# EAGLE design ENC424J600-breakout (EAGLE 6.5.0)
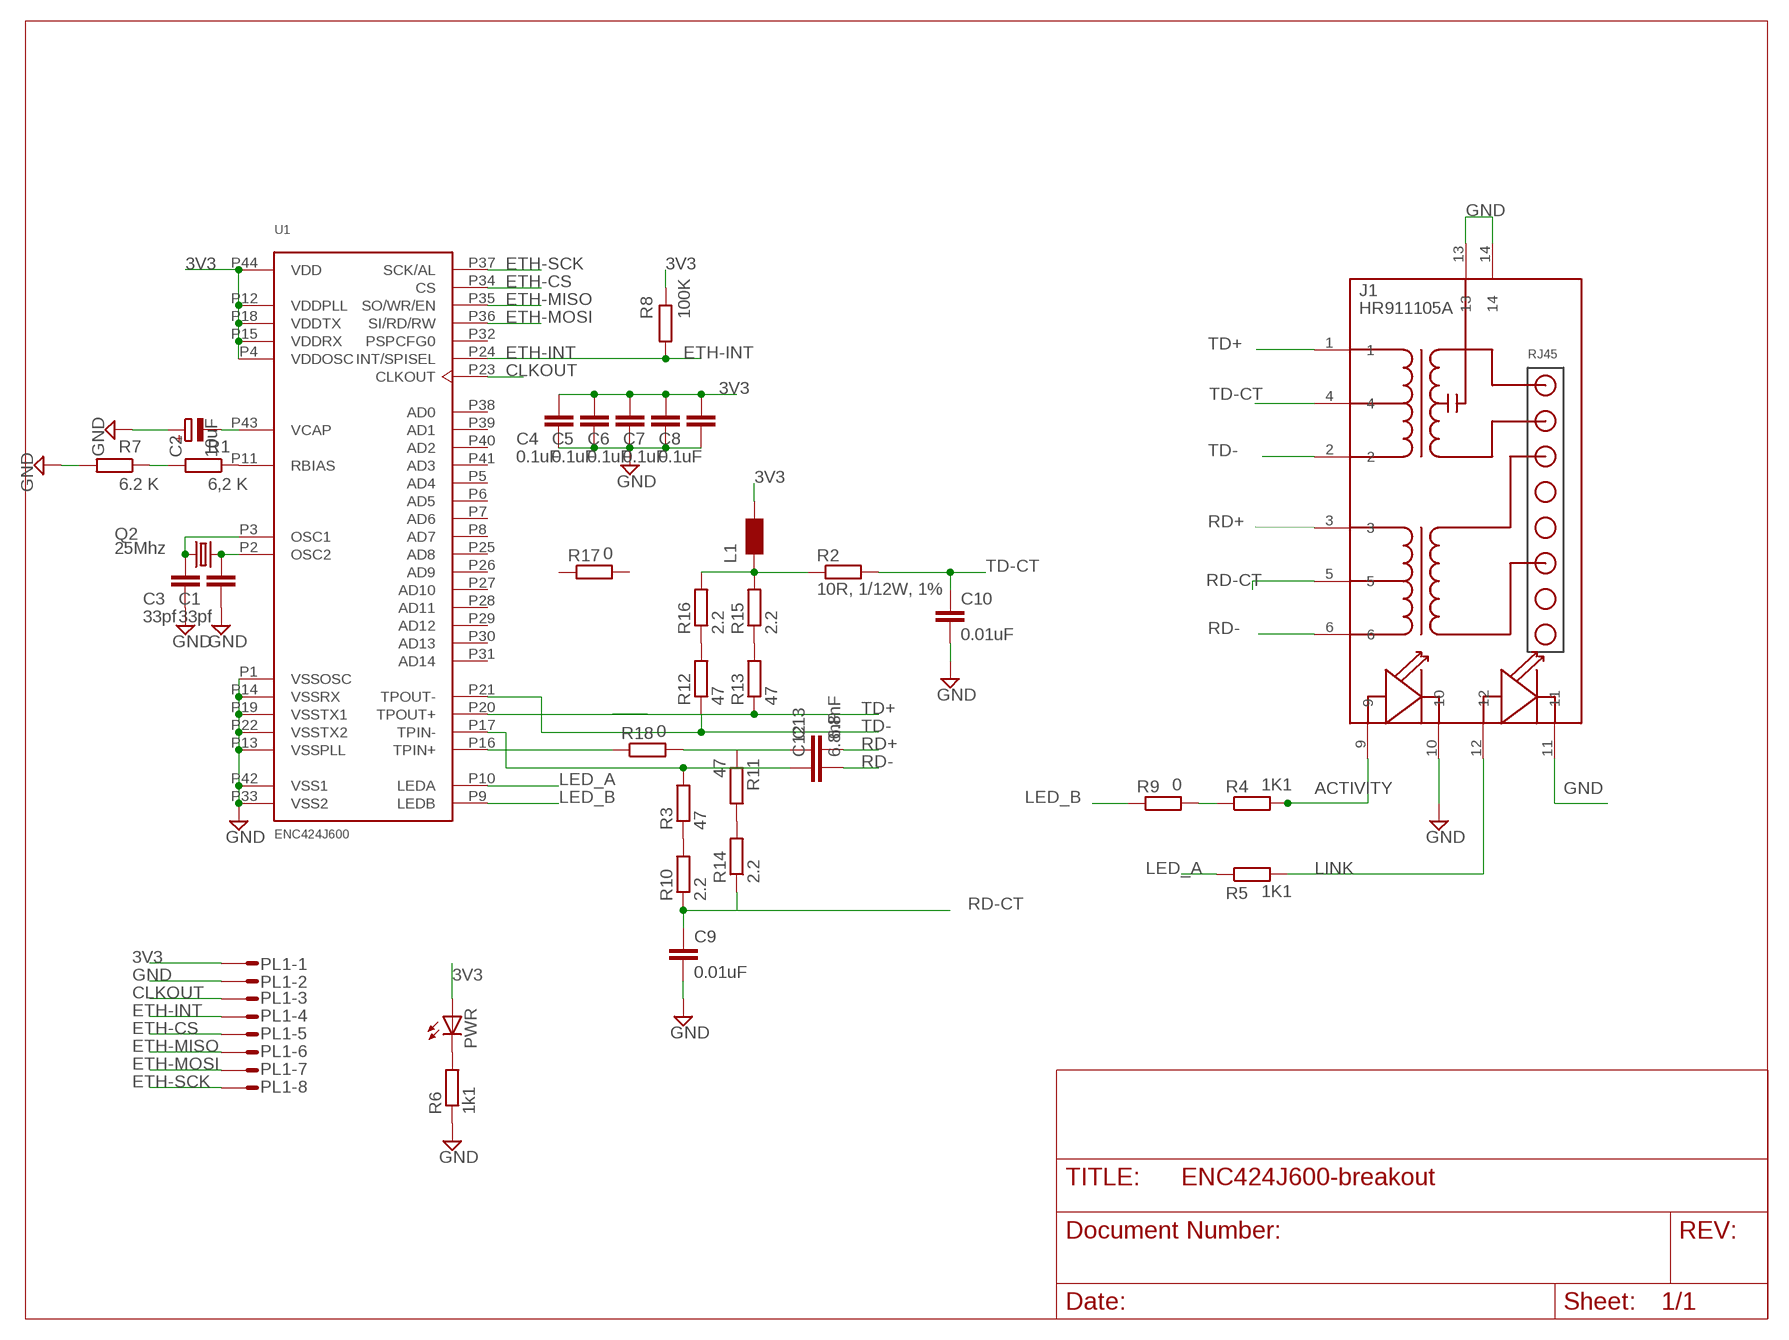
[diagram p0: schematic, sheet 1]

## Parts
C1  33pf  C-EU050-024X044  [C050-024X044]
C2  10uF  CPOL-EUE2.5-5  [E2,5-5]
C3  33pf  C-EU050-024X044  [C050-024X044]
C4  0.1uF  C-EU050-024X044  [C050-024X044]
C5  0.1uF  C-EU050-024X044  [C050-024X044]
C6  0.1uF  C-EU050-024X044  [C050-024X044]
C7  0.1uF  C-EU050-024X044  [C050-024X044]
C8  0.1uF  C-EU050-024X044  [C050-024X044]
C9  0.01uF  C-EU050-030X075  [C050-030X075]
C10  0.01uF  C-EU050-025X075  [C050-025X075]
C12  6.8nF  C-EU050-024X044  [C050-024X044]
C13  6.8nF  C-EU050-024X044  [C050-024X044]
J1  HR911105A  [HR911105A]
L1  WE-KIL_0805  [WE-KI_0805_B]
PL1  10VS  [10V]
PWR  LED805  [LED-805]
Q2  25Mhz  CRYSTALHC49U70  [HC49U70]
R1  6,2 K  R-EU_0207/7  [0207/7]
R2  10R, 1/12W, 1%  R-EU_0207/7  [0207/7]
R3  47  R-EU_0207/7  [0207/7]
R4  1K1  R-EU_0204/5  [0204/5]
R5  1K1  R-EU_0204/5  [0204/5]
R6  1k1  R-EU_0204/5  [0204/5]
R7  6.2 K  R-EU_0207/7  [0207/7]
R8  100K  R-EU_0207/7  [0207/7]
R9  0  R-EU_0204/5  [0204/5]
R10  2.2  R-EU_0207/7  [0207/7]
R11  47  R-EU_0207/7  [0207/7]
R12  47  R-EU_0207/7  [0207/7]
R13  47  R-EU_0207/7  [0207/7]
R14  2.2  R-EU_0207/7  [0207/7]
R15  2.2  R-EU_0207/7  [0207/7]
R16  2.2  R-EU_0207/7  [0207/7]
R17  0  R-EU_0204/5  [0204/5]
R18  0  R-EU_0204/5  [0204/5]
U1  ENC424J600  [TQFP44]

## Nets
3V3: C4.1 C5.1 C6.1 C7.1 C8.1 L1.1 PL1.1 PWR.A R8.1 U1.P4(VDDOSC) U1.P12(VDDPLL) U1.P15(VDDRX) U1.P18(VDDTX) U1.P44(VDD)
ACTIVITY: J1.9 R4.2
CCT: L1.2 R2.1 R15.2 R16.2
CLKOUT: PL1.3 U1.P23(CLKOUT)
DSFGDF: C12.1 R3.2 U1.P17(TPIN-)
DSGDFSG: C13.1 R11.1 R18.2
ETH-CS: PL1.5 U1.P34(CS)
ETH-INT: PL1.4 R8.2 U1.P24(INT/SPISEL)
ETH-MISO: PL1.6 U1.P35(SO/WR/EN)
ETH-MOSI: PL1.7 U1.P36(SI/RD/RW)
ETH-SCK: PL1.8 U1.P37(SCK/AL)
GND: C1.2 C2.+ C3.2 C4.2 C5.2 C6.2 C7.2 C8.2 C9.2 C10.2 J1.10 J1.11 J1.13 J1.14 PL1.2 R6.1 R7.2 U1.P1(VSSOSC) U1.P13(VSSPLL) U1.P14(VSSRX) U1.P19(VSSTX1) U1.P22(VSSTX2) U1.P33(VSS2) U1.P42(VSS1)
LED_A: R5.1 U1.P10(LEDA)
LED_B: R9.1 U1.P9(LEDB)
LINK: J1.12 R5.2
N$1: C2.- U1.P43(VCAP)
N$2: R1.1 U1.P11(RBIAS)
N$3: PWR.C R6.2
N$4: C3.1 Q2.1 U1.P3(OSC1)
N$5: R1.2 R7.1
N$6: R3.1 R10.2
N$7: R11.2 R14.2
N$8: C1.1 Q2.2 U1.P2(OSC2)
N$9: R13.2 R15.1
N$10: R12.2 R16.1
N$11: R4.1 R9.2
N$12: R18.1 U1.P16(TPIN+)
RD+: C13.2 J1.3
RD-: C12.2 J1.6
RD-CT: C9.1 J1.5 R10.1 R14.1
TD+: J1.1 R13.1 U1.P20(TPOUT+)
TD-: J1.2 R12.1 U1.P21(TPOUT-)
TD-CT: C10.1 J1.4 R2.2
Unconnected: PL1.9 PL1.10 R17.1 R17.2 U1.P5(AD4) U1.P6(AD5) U1.P7(AD6) U1.P8(AD7) U1.P25(AD8) U1.P26(AD9) U1.P27(AD10) U1.P28(AD11) U1.P29(AD12) U1.P30(AD13) U1.P31(AD14) U1.P32(PSPCFG0) U1.P38(AD0) U1.P39(AD1) U1.P40(AD2) U1.P41(AD3)

## Library data of the parts
C1 C3-C10 C12 C13 = rcl:C-EU: CAPACITOR, European symbol
C2 = resistor:CPOL-EU: POLARIZED CAPACITOR, European symbol
J1 = CONNECTER:HR911105A
L1 = wuerth-elektronik:WE-KIL: SMD Wire Wound Ceramic Inductor WE-KIL - Low profile - High Q values -- Bluetooth -- Wireless LAN -- RF oscillation circuit -- IF impedance matching
PL1 = con-harting-v:10VS: CONNECTOR; OC_FARNELL: unknown; OC_NEWARK: unknown
PWR = dp_devices:LED
Q2 = crystal:CRYSTAL: CRYSTAL; OC_FARNELL: unknown; OC_NEWARK: unknown
R1-R5 R7-R18 = rcl:R-EU_: RESISTOR, European symbol
R6 = resistor:R-EU_: RESISTOR, European symbol
U1 = dp_devices:ENC424J600: Stand-Alone 10/100 Ethernet Controller with SPI or Parallel Interface Source: http://ww1.microchip.com/downloads/en/DeviceDoc/39935c.pdf

## Board
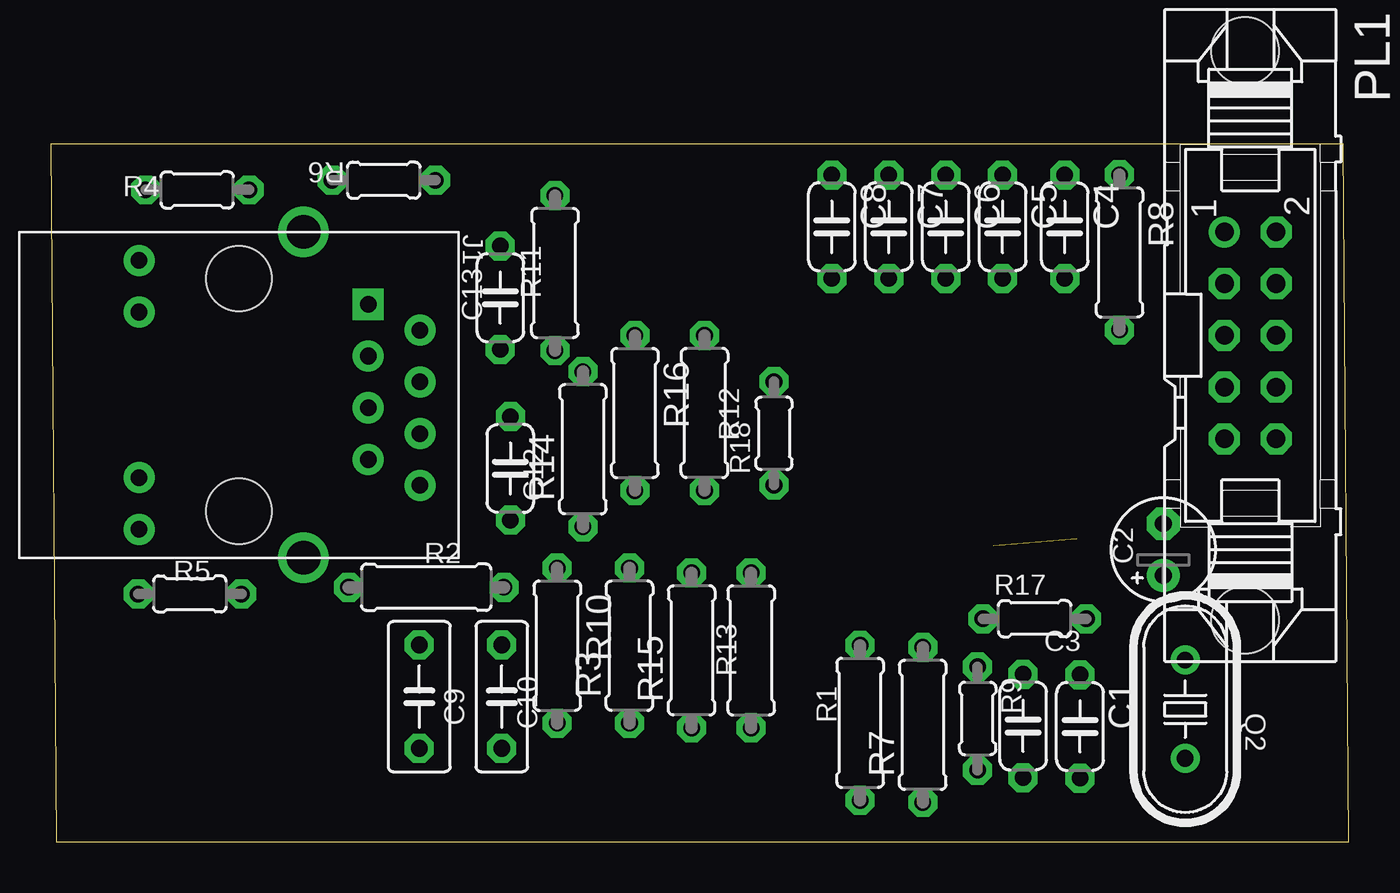
[diagram p1: board, top side]
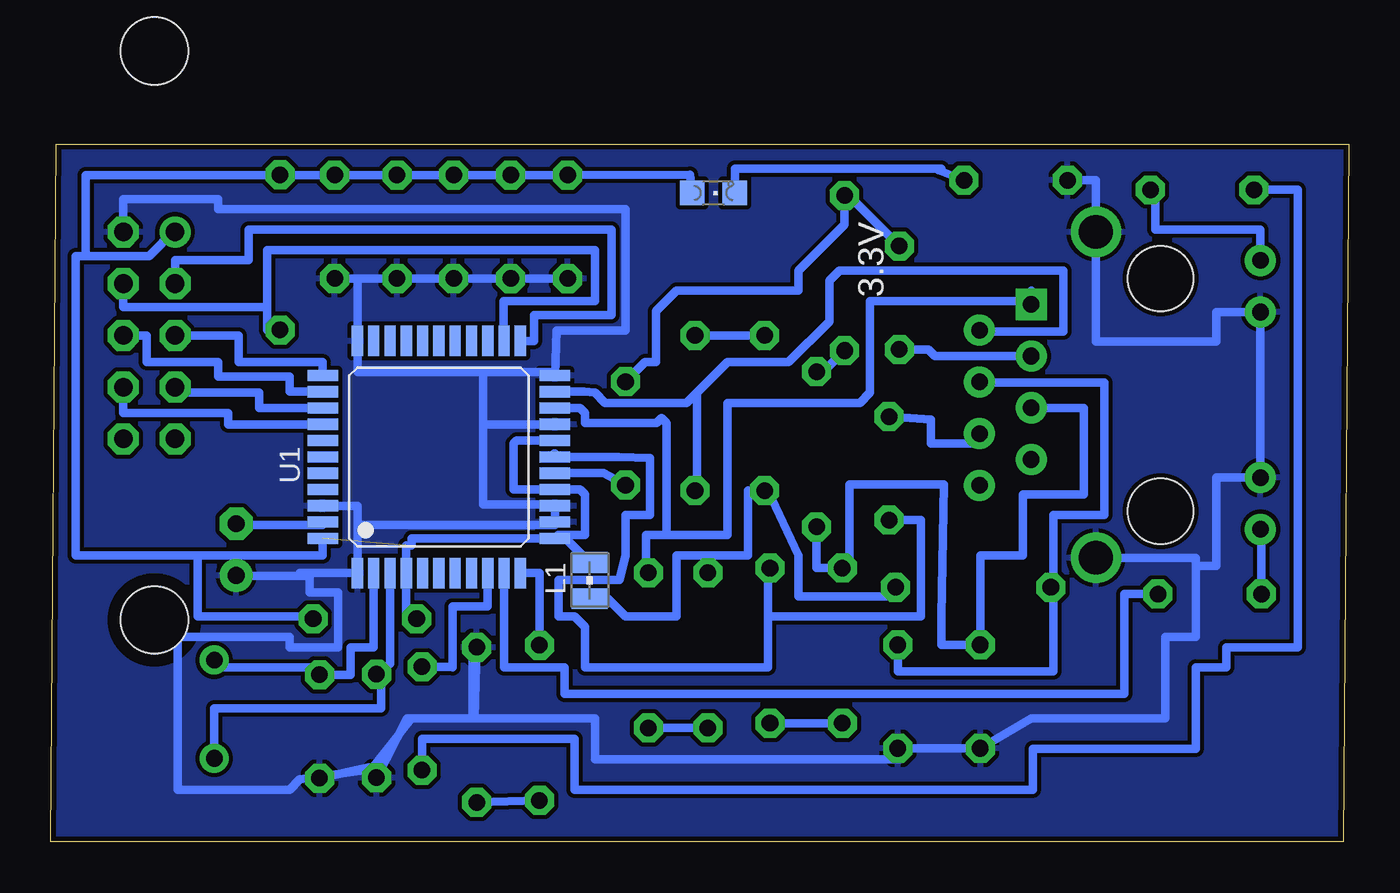
[diagram p2: board, bottom side, seen from below]

Size 63.71 x 34.27 mm. Coordinates in mm from the lower left corner, seen from the top.
Outline: 0.25,0 63.71,0 63.46,34.27 0,34.27 0.25,0
Copper layers (1*16): Top 0.035mm / dielectric 1.5mm / Bottom 0.035mm
Design rules "SparkFun *": minimum track width 8mil, minimum drill 15mil, track to track 8mil, track to pad 8mil, pad to pad 8mil, via to via 8mil, smd to smd 8mil, copper to edge 10mil, drill to drill 8mil, minimum pad ring 12mil, minimum via ring 10mil, stop-mask expansion 4mil, vias tented up to drill 25mil, thermal gap 8mil

### Footprints (pad centres in the part's own frame; a part is rotated, then mirrored left to right if it is on the bottom)
C050-024X044 = drill 0.813 octagon: 1 -2.54,0; 2 2.54,0
E2,5-5 = drill 0.813 pad 1.6: + -1.27,0 | drill 0.813 pad 1.6 octagon: - 1.27,0
C050-030X075 = drill 0.813 octagon: 1 -2.54,0; 2 2.54,0
C050-025X075 = drill 0.813 octagon: 1 -2.54,0; 2 2.54,0
HR911105A = drill 0.813 pad 1.524 square: 1 4.445,-6.35 | drill 0.813 pad 1.524: 2 3.175,-8.89; 3 1.905,-6.35; 4 0.635,-8.89; 5 -0.635,-6.35; 6 -1.905,-8.89; 7 -3.175,-6.35; 8 -4.445,-8.89; 9 6.604,4.902; 10 4.064,4.902; 11 -4.064,4.902; 12 -6.604,4.902 | drill 1.651 pad 2.159: 13 8.001,-3.175; 14 -8.001,-3.175 | hole 3.2: 5.715,0; -5.715,0
WE-KI_0805_B = smd 1.02 x 1.78: 1 -0.89,0; 2 0.89,0
10V = drill 0.914: 1 -5.08,-1.27 | drill 0.914 octagon: 2 -5.08,1.27; 3 -2.54,-1.27; 4 -2.54,1.27; 5 0,-1.27; 6 0,1.27; 7 2.54,-1.27; 8 2.54,1.27; 9 5.08,-1.27; 10 5.08,1.27 | hole 3.302: 13.97,-0.254; -13.97,-0.254
LED-805 = smd 1.2 x 1.2: A 0,-1.05; C 0,1.05
HC49U70 = drill 0.813: 1 -2.413,0; 2 2.413,0
0207/7 = drill 0.813 octagon: 1 -3.81,0; 2 3.81,0
0204/5 = drill 0.813 octagon: 1 -2.54,0; 2 2.54,0
TQFP44 = smd 0.55 x 1.5: P1 -4,-5.7; P2 -3.2,-5.7; P3 -2.4,-5.7; P4 -1.6,-5.7; P5 -0.8,-5.7; P6 0,-5.7; P7 0.8,-5.7; P8 1.6,-5.7; P9 2.4,-5.7; P10 3.2,-5.7; P11 4,-5.7; P23 4,5.7; P24 3.2,5.7; P25 2.4,5.7; P26 1.6,5.7; P27 0.8,5.7; P28 0,5.7; P29 -0.8,5.7; P30 -1.6,5.7; P31 -2.4,5.7; P32 -3.2,5.7; P33 -4,5.7 | smd 1.5 x 0.55: P12 5.7,-4; P13 5.7,-3.2; P14 5.7,-2.4; P15 5.7,-1.6; P16 5.7,-0.8; P17 5.7,0; P18 5.7,0.8; P19 5.7,1.6; P20 5.7,2.4; P21 5.7,3.2; P22 5.7,4; P34 -5.7,4; P35 -5.7,3.2; P36 -5.7,2.4; P37 -5.7,1.6; P38 -5.7,0.8; P39 -5.7,0; P40 -5.7,-0.8; P41 -5.7,-1.6; P42 -5.7,-2.4; P43 -5.7,-3.2; P44 -5.7,-4

### Placement (x,y rotation side)
C1  50.52,5.66 270 top
C2  54.62,14.35 90 top
C3  47.73,5.69 270 top
C4  49.78,30.2 270 top
C5  46.73,30.2 270 top
C6  43.93,30.2 270 top
C7  41.14,30.2 270 top
C8  38.35,30.2 270 top
C9  18.08,7.13 270 top
C10  22.14,7.13 270 top
C12  22.56,18.33 90 top
C13  22.06,26.72 270 top
J1  9.23,21.95 90 top
L1  37.27,12.83 270 bottom
PL1  58.89,24.87 270 top
PWR  31.18,31.86 270 bottom
Q2  55.69,6.51 90 top
R1  39.73,5.84 270 top
R2  18.43,12.5 180 top
R3  28.41,9.63 90 top
R4  7.18,32.01 0 top
R5  6.82,12.17 180 top
R6  16.34,32.49 0 top
R7  42.81,5.74 90 top
R8  52.46,28.94 270 top
R9  45.5,6.06 270 top
R10  24.86,9.63 270 top
R11  24.75,27.93 270 top
R12  32.09,21.06 90 top
R13  34.38,9.4 270 top
R14  26.12,19.28 90 top
R15  31.46,9.4 90 top
R16  28.67,21.06 270 top
R17  48.3,10.96 0 top
R18  35.5,20.06 90 top
U1  44.66,18.9 0 bottom

### Tracks (layer width: path | path; a pad name or v marks a point on that pad's centre or on a via)
3V3  (1 unrouted)
  Bottom 0.406: U1.P12 46,14.9 46,14.56 46.26,14.56 U1.P4 46.26,11.06 45.5,11.06 | U1.P44 50.36,14.06 56.5,14.06 | 56.5,14.06 62.5,14.06 62.5,28.76 62,28.76 | 62,28.76 58.9,28.76 57.62,30.06 PL1.1 | 56.5,14.06 56.5,11.06 50.5,11.06 | 52.5,32.74 C4.1 C5.1 C6.1 C7.1 C8.1 32.35,32.76 PWR.A | 52.5,32.74 62,32.74 62,28.76 | R8.1 52.5,32.75 52.5,32.74 | U1.P18 40.86,19.7 41,19.56 41,17.3 U1.P15 37.74,17.3 37.5,17.06 37.5,15.06 38.81,15.06 U1.P12 | L1.1 38.45,14.9 U1.P12
ACTIVITY
  Bottom 0.406: R4.2 9.5,32.01 9.5,30.06 4.33,30.06 J1.9
CCT
  Bottom 0.406: 31.46,14.06 33,14.06 33,11.06 35.5,11.06 36.38,11.94 L1.2 | 31.46,14.06 R15.2 | 31.46,14.06 29.5,14.06 29.5,17.25 R16.2 28.5,17.25 27,14.06 27,12.06 22.24,12.06 R2.1
CLKOUT
  Bottom 0.406: PL1.3 57.62,28.56 54,28.56 54,30.06 36.2,30.06 36.2,25.86 40,25.86 40,24.6 U1.P23
DSFGDF
  Bottom 0.406: R3.2 28.5,13.44 28.5,11.06 | 28.5,11.06 28.5,8.56 37.5,8.56 37.5,10.56 38,11.06 38.8,11.06 38.8,12.86 35.8,12.86 35.5,14.06 35.5,16.06 34.3,16.06 34.3,18.86 35.84,18.9 U1.P17 39,18.93 39,19.06 38.96,19.06 | C12.1 21,15.79 21,11.06 28.5,11.06
DSGDFSG
  Bottom 0.406: C13.1 24.54,31.74 R11.1 24.75,30.31 27,28.06 27,27.06 33,27.06 34,26.06 34,23.56 34.54,23.56 R18.2
ETH-CS
  Bottom 0.406: PL1.5 54.5,24.87 54.5,23.56 50.36,23.56 U1.P34
ETH-INT
  Bottom 0.406: PL1.4 60.16,26.26 53.1,26.26 | 53.1,26.26 53.1,29.06 37,29.06 37,26.56 41.5,26.56 41.5,24.6 U1.P24 | R8.2 53.1,25.13 53.1,26.26
ETH-MISO
  Bottom 0.406: PL1.6 59,24.87 59,23.56 55.5,23.56 55.5,22.86 52,22.86 52,22.1 U1.P35
ETH-MOSI
  Bottom 0.406: PL1.7 57.62,22.06 53.5,22.06 53.5,21.3 U1.P36
ETH-SCK
  Bottom 0.406: PL1.8 60.16,21.06 55,21.06 55,20.5 U1.P37
GND
  Bottom 0.406: R6.1 12.41,32.49 J1.13 12.41,24.56 6.5,24.56 6.5,26.01 J1.10 J1.11 6.5,17.88 6.5,13.56 7.5,13.56 | J1.14 7.5,13.95 7.5,13.56 | 7.5,13.56 7.5,10.06 9,10.06 9,6.06 15.58,6.06 C9.2 C10.2 22,4.09 22,4.06 37,4.06 37,6.06 42.91,6.06 | 42.91,6.06 R7.2 43,9.65 43,6.06 | C1.2 48.12,3.65 C3.2 46.23,6.06 46,6.06 | 42.91,6.06 43,6.06 | 51,13.06 51.5,13.2 U1.P1 48.66,15.56 | U1.P42 48.66,16.5 48.66,15.56 | 43,6.06 46,6.06 | 46,6.06 48,3.56 51.5,3.06 52,2.56 57.5,2.56 57.5,10.06 52,10.06 52,9.56 49.6,9.56 49.6,12.26 51,12.26 51,13.06 | 51,13.06 55.12,13.06 | 48.66,15.56 38.96,15.56 U1.P13 U1.P14 39.02,16.56 42.5,16.56 42.5,20.5 | C5.2 48.66,27.66 U1.P33 48.66,23.06 42.5,23.06 | PL1.2 60.16,31.56 55.5,31.56 55.5,31.06 35.5,31.06 35.5,25.1 38.9,25.1 U1.P22 | U1.P22 38.96,23.06 39.12,23.06 | C5.2 C4.2 | C5.2 C6.2 C7.2 C8.2 | 42.5,20.5 U1.P19 | U1.P22 arc-90 39.12,23.06 | 39.12,23.06 42.5,23.06 | 42.5,23.06 42.5,20.5
  pour Bottom: 0,34.27 63.46,34.27 63.46,0 0.25,0
LED_A
  Bottom 0.406: R5.1 11,12.17 11,7.26 38.5,7.26 38.5,8.56 41.46,8.56 U1.P10
LED_B
  Bottom 0.406: R9.1 44,8.6 | 44,8.6 44,8.56 | 44,8.6 44,11.56 42.26,11.56 U1.P9
LINK
  Bottom 0.406: J1.12 4.28,15.34 R5.2
N$1
  Bottom 0.406: C2.- 54.5,15.44 54,15.56 50.36,15.56 U1.P43
N$2
  Bottom 0.406: U1.P11 39.73,13.2 R1.1
N$3
  Bottom 0.406: R6.2 20.14,32.99 20,33.06 30.14,33.06 PWR.C
N$4
  Bottom 0.406: U1.P3 47.06,8.73 C3.1 47.5,8.73 47.5,6.56 55.69,6.56 Q2.1
N$5
  Bottom 0.406: R7.1 R1.2
N$6
  Bottom 0.406: R3.1 R10.2
N$7
  Bottom 0.406: R11.2 25.78,23.09 R14.2
N$8
  Bottom 0.406: U1.P2 47.86,9.56 49,9.56 49,8.2 C1.1 51.02,8.56 55.5,8.56 55.5,8.92 Q2.2
N$9
  Bottom 0.406: R13.2 R15.1
N$10
  Bottom 0.406: R16.1 R12.2
N$11
  Bottom 0.406: R4.1 2.5,32.01 2.5,9.56 6,9.56 6,8.56 7.5,8.56 7.5,4.56 15.5,4.56 15.5,2.56 38,2.56 38,5.06 45.5,5.06 R9.2
N$12
  Bottom 0.406: R18.1 36.58,18.1 U1.P16
RD+
  Bottom 0.406: J1.3 20.3,23.86 20.62,24.18 C13.2
RD-
  Bottom 0.406: C12.2 20.5,20.74 20.5,19.56 18.12,19.56 J1.6
RD-CT
  Bottom 0.406: J1.5 13,21.31 13,17.06 16,17.06 16,14.06 18.08,14.06 C9.1 20,9.67 20,11.06 19.86,17.56 24.5,17.56 24.5,13.44 R10.1 26.12,13.44 R14.1
TD+
  Bottom 0.406: 15.58,27.06 J1.1 15.74,26.56 23.5,26.56 23.5,22.06 24,21.56 30.5,21.56 30.5,15.06 33.5,15.06 | R13.1 34.5,13.71 34.5,15.06 33.5,15.06 | 33.5,15.06 33.5,20.56 33.74,20.8 33.99,20.56 37.5,20.56 37.5,21.06 37.74,21.3 U1.P20
TD-
  Bottom 0.406: R12.1 32,16.75 32,22.06 | J1.2 18.05,25.06 14,25.06 14,28.06 25,28.06 25.5,27.56 25.5,25.56 27.5,23.56 30.5,23.56 32,22.06 | 32,22.06 32.5,21.56 36.5,21.56 37,22.06 37.54,22.1 U1.P21
TD-CT
  Bottom 0.406: 14.5,12.5 14.5,16.06 12,16.06 12,22.56 18.12,22.56 J1.4 | R2.2 14.5,12.5 | 14.5,12.5 14.5,8.36 22.14,8.36 C10.1

### Text on the board
bNames: 3.3V